# EAGLE design schematic_v2 (EAGLE 9.5.0)
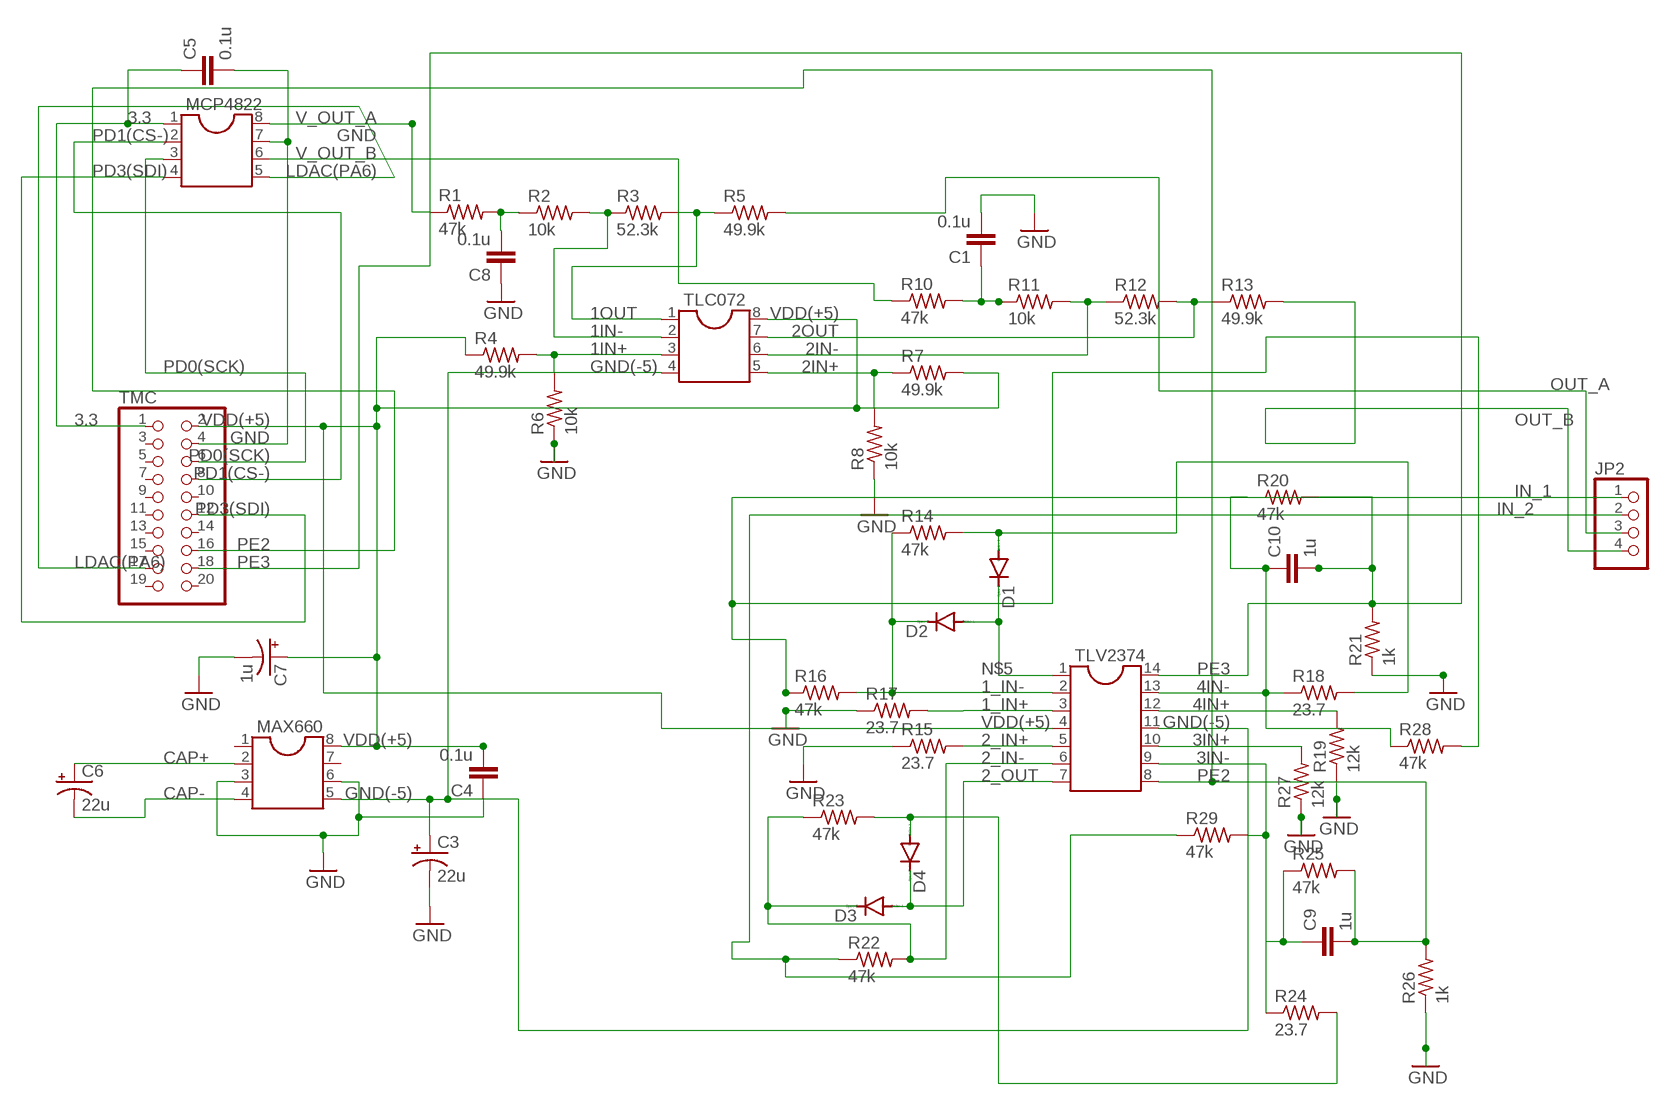
[diagram p0: schematic, sheet 1]

## Parts
C1  0.1u  C2.5/2  [C2.5-2]
C3  22u  CPOL-USE2.5-6  [E2,5-6]
C4  0.1u  C2.5/2  [C2.5-2]
C5  0.1u  C2.5/2  [C2.5-2]
C6  22u  CPOL-USE2.5-6  [E2,5-6]
C7  1u  CPOL-USE2.5-6  [E2,5-6]
C8  0.1u  C2.5/2  [C2.5-2]
C9  1u  C2.5/2  [C2.5-2]
C10  1u  C2.5/2  [C2.5-2]
D1  1N4148DO35-7  [DO35-7]
D2  1N4148DO35-7  [DO35-7]
D3  1N4148DO35-7  [DO35-7]
D4  1N4148DO35-7  [DO35-7]
JP2  PINHD-1X4  [1X04]
MAX660  DIL8  [DIL08]
MCP4822  DIL8  [DIL08]
R1  47k  R-US_0207/10  [0207/10]
R2  10k  R-US_0207/10  [0207/10]
R3  52.3k  R-US_0207/10  [0207/10]
R4  49.9k  R-US_0207/10  [0207/10]
R5  49.9k  R-US_0207/10  [0207/10]
R6  10k  R-US_0207/10  [0207/10]
R7  49.9k  R-US_0207/10  [0207/10]
R8  10k  R-US_0207/10  [0207/10]
R10  47k  R-US_0207/10  [0207/10]
R11  10k  R-US_0207/10  [0207/10]
R12  52.3k  R-US_0207/10  [0207/10]
R13  49.9k  R-US_0207/10  [0207/10]
R14  47k  R-US_0207/10  [0207/10]
R15  23.7  R-US_0207/10  [0207/10]
R16  47k  R-US_0207/10  [0207/10]
R17  23.7  R-US_0207/10  [0207/10]
R18  23.7  R-US_0207/10  [0207/10]
R19  12k  R-US_0207/10  [0207/10]
R20  47k  R-US_0207/10  [0207/10]
R21  1k  R-US_0207/10  [0207/10]
R22  47k  R-US_0207/10  [0207/10]
R23  47k  R-US_0207/10  [0207/10]
R24  23.7  R-US_0207/10  [0207/10]
R25  47k  R-US_0207/10  [0207/10]
R26  1k  R-US_0207/10  [0207/10]
R27  12k  R-US_0207/10  [0207/10]
R28  47k  R-US_0207/10  [0207/10]
R29  47k  R-US_0207/10  [0207/10]
TLC072  DIL8  [DIL08]
TLV2374  DIL14  [DIL14]
TMC  PINHD-2X10  [2X10]

## Nets
1_IN+: R17.2 TLV2374.3
1_IN-: D2.C R14.1 R16.2 TLV2374.2
1_OUT: D1.A R14.2 R18.2
1IN+: R4.2 R6.2 TLC072.3
1IN-: R2.2 R3.1 TLC072.2
1OUT: R3.2 R5.1 TLC072.1
2_IN+: R15.2 TLV2374.5
2_IN-: D3.C R22.2 R23.1 TLV2374.6
2_OUT: D3.A D4.C TLV2374.7
2IN+: R7.1 R8.2 TLC072.5
2IN-: R11.2 R12.1 TLC072.6
2OUT: R12.2 R13.1 TLC072.7
3.3: C5.1 MCP4822.1 TMC.1
3IN+: R27.2 TLV2374.10
3IN-: C9.1 R24.1 R25.1 R29.2 TLV2374.9
4IN+: R19.2 TLV2374.12
4IN-: C10.1 R18.1 R20.1 R28.1 TLV2374.13
CAP+: C6.+ MAX660.2
CAP-: C6.- MAX660.4
GND: C1.2 C3.- C4.1 C5.2 C7.- C8.1 MAX660.3 MAX660.6 MCP4822.7 R6.1 R8.1 R15.1 R17.1 R19.1 R21.1 R26.1 R27.1 TMC.4
GND(-5): C3.+ MAX660.5 TLC072.4 TLV2374.11
IN_1: JP2.1 R16.1 R28.2
IN_2: JP2.2 R22.1 R29.1
LDAC(PA6): MCP4822.5 TMC.17
N$1: R10.2 R11.1
N$2: C8.2 R1.2 R2.1
N$3: D4.A R23.2 R24.2
N$4: C1.1
N$5: D1.C D2.A TLV2374.1
OUT_A: JP2.3 R5.2
OUT_B: JP2.4 R13.2
PD0(SCK): MCP4822.3 TMC.6
PD1(CS-): MCP4822.2 TMC.8
PD3(SDI): MCP4822.4 TMC.12
PE2: C9.2 R25.2 R26.2 TLV2374.8 TMC.16
PE3: C10.2 R20.2 R21.2 TLV2374.14 TMC.18
V_OUT_A: MCP4822.8 R1.1
V_OUT_B: MCP4822.6 R10.1
VDD(+5): C4.2 C7.+ MAX660.8 R4.1 R7.2 TLC072.8 TLV2374.4 TMC.2
Unconnected: MAX660.1 MAX660.7 TMC.3 TMC.5 TMC.7 TMC.9 TMC.10 TMC.11 TMC.13 TMC.14 TMC.15 TMC.19 TMC.20

## Library data of the parts
C1 C4 C5 C8-C10 = capacitor-wima:C: CAPACITOR naming: grid - package width
C3 C6 C7 = adafruit:CPOL-US: POLARIZED CAPACITOR, American symbol
D1-D4 = diode:1N4148: DIODE high speed (Philips)
JP2 = pinhead:PINHD-1X4: PIN HEADER
MAX660 MCP4822 TLC072 = ic-package:DIL8: Dual In Line / Socket
R1-R8 R10-R29 = adafruit:R-US_: RESISTOR, American symbol
TLV2374 = ic-package:DIL14: Dual In Line / Socket
TMC = pinhead:PINHD-2X10: PIN HEADER

## Net classes
0 default: width 0.66 mm, drill 0.66 mm, clearance 0.66 mm

## Board
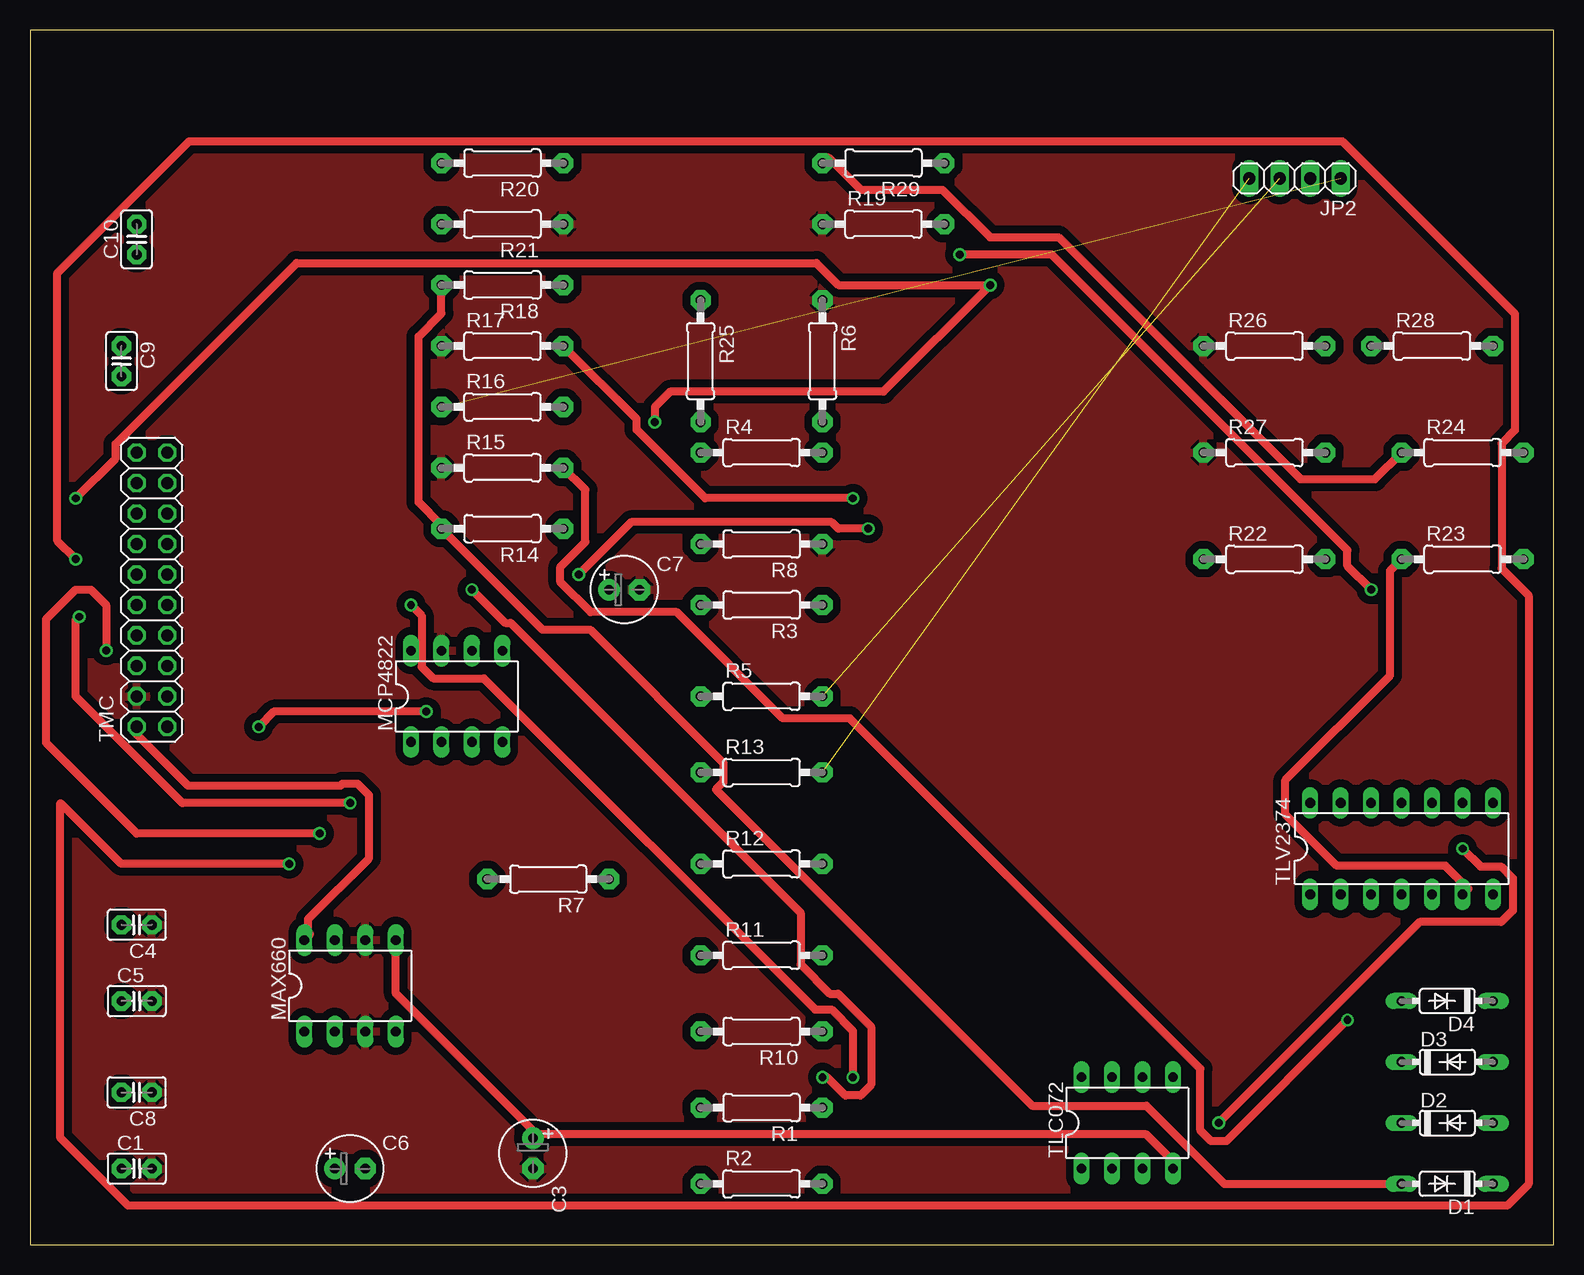
[diagram p1: board, top side]
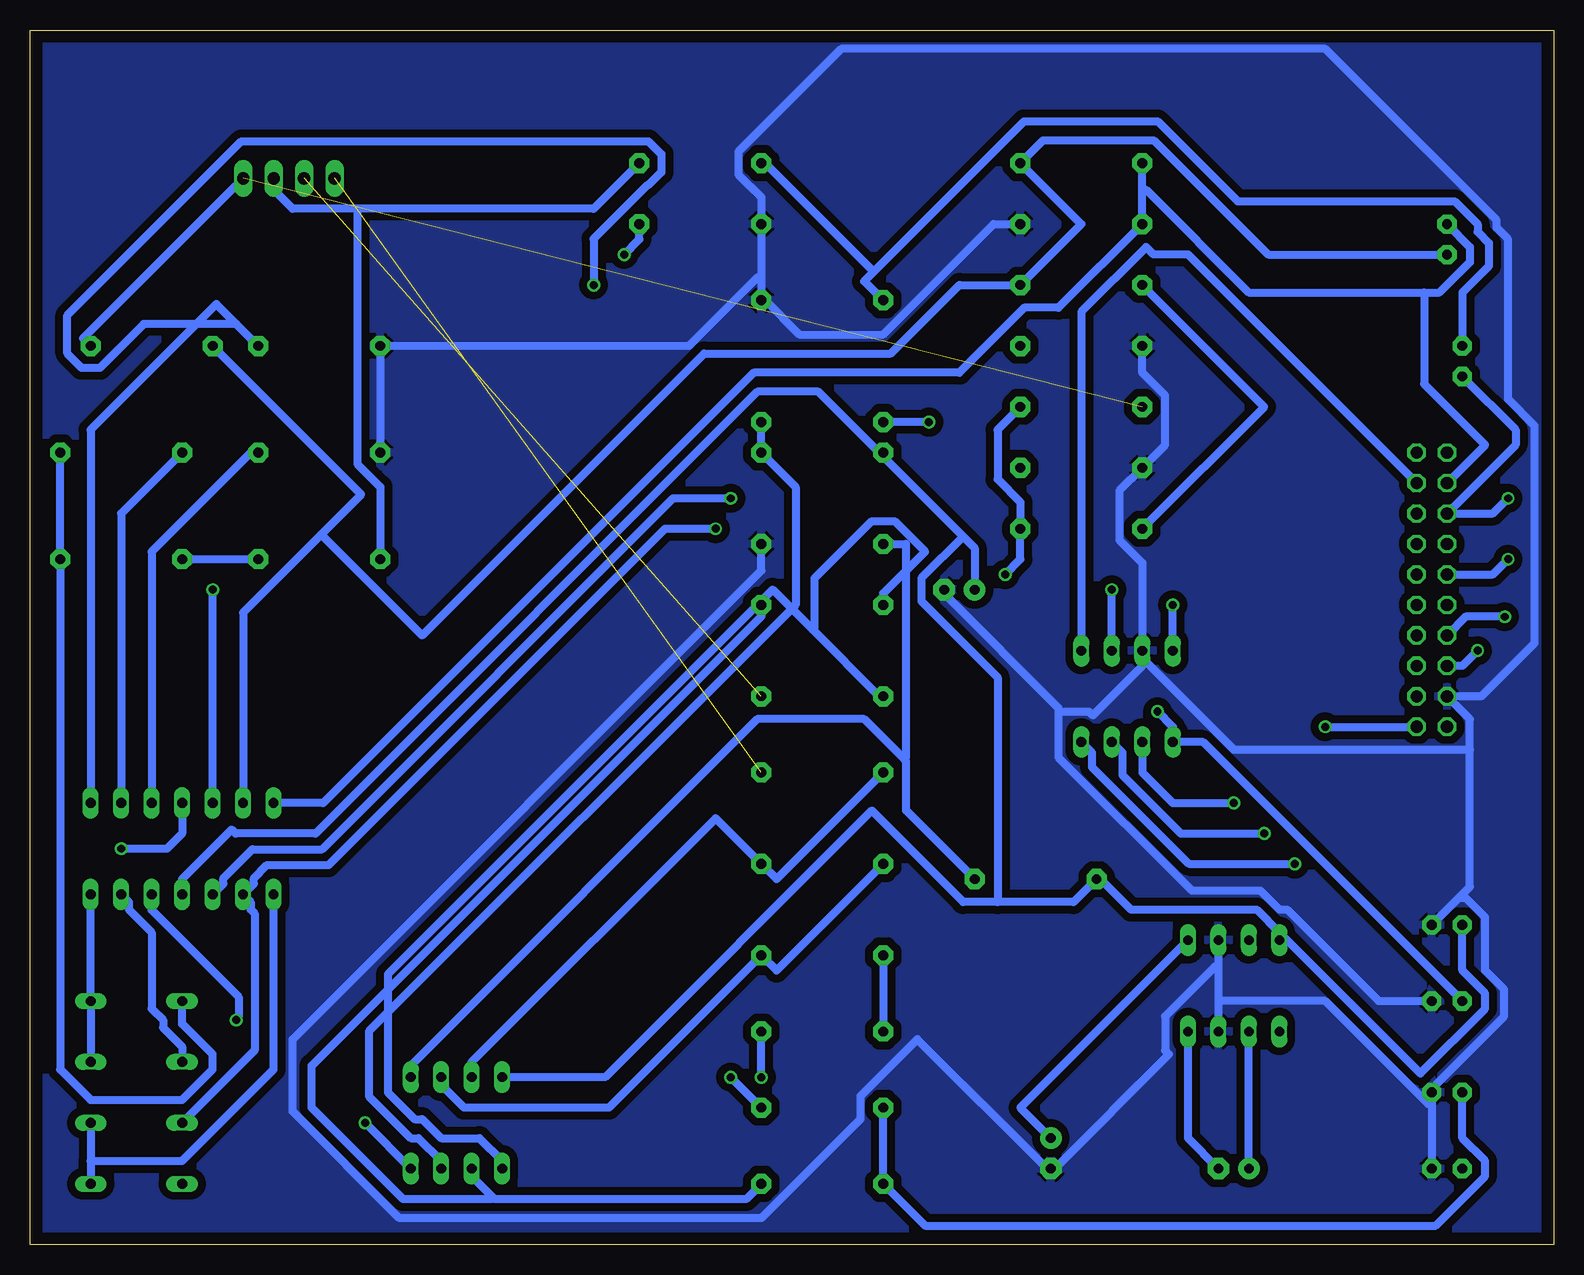
[diagram p2: board, bottom side, seen from below]

Size 126.98 x 101.27 mm. Coordinates in mm from the lower left corner, seen from the top.
Outline: 0,0 126.98,0 126.98,101.27 0,101.27 0,0
Copper layers (1*16): Top 0.035mm / dielectric 1.5mm / Bottom 0.035mm
Design rules "default": minimum track width 6mil, minimum drill 0.35mm, track to track 6mil, track to pad 6mil, pad to pad 6mil, via to via 6mil, smd to smd 6mil, copper to edge 40mil, drill to drill 6mil, minimum pad ring 10mil, minimum via ring 8mil, stop-mask expansion 4mil, vias tented up to drill 0mil, thermal gap 10mil

### Footprints (pad centres in the part's own frame; a part is rotated, then mirrored left to right if it is on the bottom)
C2.5-2 = drill 0.813 pad 1.6 octagon: 1 -1.27,0; 2 1.27,0
E2,5-6 = drill 0.813 pad 1.778: + -1.27,0 | drill 0.813 pad 1.778 octagon: - 1.27,0
DO35-7 = drill 0.813 long: A 3.81,0; C -3.81,0
1X04 = drill 1.016 long: 1 -3.81,0; 2 -1.27,0; 3 1.27,0; 4 3.81,0
DIL08 = drill 0.813 long: 1 -3.81,-3.81; 2 -1.27,-3.81; 3 1.27,-3.81; 4 3.81,-3.81; 5 3.81,3.81; 6 1.27,3.81; 7 -1.27,3.81; 8 -3.81,3.81
0207/10 = drill 0.813 pad 1.676 octagon: 1 -5.08,0; 2 5.08,0
DIL14 = drill 0.813 long: 1 -7.62,-3.81; 2 -5.08,-3.81; 3 -2.54,-3.81; 4 0,-3.81; 5 2.54,-3.81; 6 5.08,-3.81; 7 7.62,-3.81; 8 7.62,3.81; 9 5.08,3.81; 10 2.54,3.81; 11 0,3.81; 12 -2.54,3.81; 13 -5.08,3.81; 14 -7.62,3.81
2X10 = drill 1.016 octagon: 1 -11.43,-1.27; 2 -11.43,1.27; 3 -8.89,-1.27; 4 -8.89,1.27; 5 -6.35,-1.27; 6 -6.35,1.27; 7 -3.81,-1.27; 8 -3.81,1.27; 9 -1.27,-1.27; 10 -1.27,1.27; 11 1.27,-1.27; 12 1.27,1.27; 13 3.81,-1.27; 14 3.81,1.27; 15 6.35,-1.27; 16 6.35,1.27; 17 8.89,-1.27; 18 8.89,1.27; 19 11.43,-1.27; 20 11.43,1.27

### Placement (x,y rotation side)
C1  8.89,6.35 0 top
C3  41.91,7.62 270 top
C4  8.89,26.67 180 top
C5  8.89,20.32 0 top
C6  26.67,6.35 0 top
C7  49.53,54.61 0 top
C8  8.89,12.7 180 top
C9  7.62,73.66 270 top
C10  8.89,83.82 90 top
D1  118.11,5.08 180 top
D2  118.11,10.16 0 top
D3  118.11,15.24 0 top
D4  118.11,20.32 180 top
JP2  105.41,88.9 180 top
MAX660  26.67,21.59 0 top
MCP4822  35.56,45.72 0 top
R1  60.96,11.43 180 top
R2  60.96,5.08 0 top
R3  60.96,53.34 180 top
R4  60.96,66.04 0 top
R5  60.96,45.72 0 top
R6  66.04,73.66 270 top
R7  43.18,30.48 180 top
R8  60.96,58.42 180 top
R10  60.96,17.78 180 top
R11  60.96,24.13 0 top
R12  60.96,31.75 0 top
R13  60.96,39.37 0 top
R14  39.37,59.69 180 top
R15  39.37,64.77 0 top
R16  39.37,69.85 0 top
R17  39.37,74.93 0 top
R18  39.37,80.01 180 top
R19  71.12,85.09 0 top
R20  39.37,90.17 180 top
R21  39.37,85.09 180 top
R22  102.87,57.15 0 top
R23  119.38,57.15 0 top
R24  119.38,66.04 0 top
R25  55.88,73.66 270 top
R26  102.87,74.93 0 top
R27  102.87,66.04 0 top
R28  116.84,74.93 0 top
R29  71.12,90.17 180 top
TLC072  91.44,10.16 0 top
TLV2374  114.3,33.02 0 top
TMC  10.16,54.61 90 top

### Tracks (layer width: path | path; a pad name or v marks a point on that pad's centre or on a via)
1_IN+  (via drill 0.66)
  Top 0.66: R17.2 50.55,68.83 50.55,67.95 56.27,62.23 v68.58,62.23
  Bottom 0.66: TLV2374.3 110.87,30.1 110.87,30.55 108.46,32.97 102.64,32.97 73.38,62.23 v68.58,62.23
1_IN-  (via drill 0.66)
  Top 0.66: v69.85,59.69 67.36,59.69 66.8,60.25 50.09,60.25 v45.72,55.88
  Bottom 0.66: R16.2 46.35,67.94 46.35,63.82 44.45,61.91 R14.1 44.45,57.15 v45.72,55.88 | D2.C 108.27,16.19 108.27,27.62 108.58,27.94 108.58,28.57 TLV2374.2 108.33,30.1 108.33,30.55 107.24,31.65 102.09,31.65 74.05,59.69 v69.85,59.69
1_OUT
  Top 0.66: D1.A 99.54,5.08 93.03,11.59 83.5,11.59 57.15,37.94 57.78,38.58 57.78,40.16 46.67,51.28 42.7,51.28 R14.2 34.29,60.01 32.38,61.91 32.38,75.72 34.29,77.63 R18.2
  Bottom 0.66: R14.2 24.13,69.85 R18.2
1IN+
  Bottom 0.66: TLC072.3 92.71,6.99 94.61,8.89 95.25,8.89 98.74,12.38 98.74,17.78 63.18,53.34 63.18,63.18 R4.2 R6.2
1IN-
  Bottom 0.66: TLC072.2 90.17,5.71 88.42,3.97 | 88.42,3.97 88.27,3.81 67.31,3.81 R2.2 | R3.1 66.04,52.39 103.5,14.92 103.5,11.43 95.89,3.81 88.58,3.81 88.42,3.97
1OUT
  Bottom 0.66: TLC072.1 87.63,6.99 89.53,8.89 92.71,8.89 94.3,10.48 94.93,10.48 97.16,12.7 97.16,22.54 65.09,54.61 61.75,51.28 | 61.75,51.28 56.2,45.72 R5.1 | R3.2 55.88,54.29 52.39,57.78 54.93,60.33 56.83,60.33 61.59,55.56 61.59,51.44 61.75,51.28
2_IN+  (via drill 0.66)
  Top 0.66: R15.2 46.28,62.94 46.28,58.59 44.2,56.51 44.2,55.25 46.71,52.73 53.9,52.73 62.74,43.89 68.32,43.89 97.54,14.68 97.54,9.53 98.43,8.64 99.69,8.64 v109.79,18.74
  Bottom 0.66: TLV2374.5 116.84,27.9 109.59,20.65 109.59,18.94 v109.79,18.74
2_IN-
  Top 0.66: R23.1 113.35,56.2 113.35,47.47 104.62,38.73 104.62,35.88 108.9,31.59 117.95,31.59 119.86,29.69 TLV2374.6
  Bottom 0.66: D3.C 114.3,16.51 115.89,18.1 115.89,18.73 116.84,19.68 116.84,26.04 118.75,27.94 118.75,28.57 TLV2374.6 | R23.1 R22.2
2_OUT
  Bottom 0.66: D3.A D4.C TLV2374.7
2IN+
  Bottom 0.66: TLC072.5 95.25,14.92 66.36,43.81 57.47,43.81 54.13,40.48 | 54.13,40.48 53.98,40.32 53.98,36.2 R7.1 | R8.2 53.98,58.42 53.98,40.64 54.13,40.48
2IN-
  Bottom 0.66: TLC072.6 92.71,13.34 90.81,11.43 78.74,11.43 R11.2 64.77,22.86 R12.1
2OUT
  Bottom 0.66: TLC072.7 90.17,15.24 69.85,35.56 R12.2 64.77,30.48 R13.1
3.3  (via drill 0.66)
  Top 0.66: v33.02,44.45 20.32,44.45 v19.05,43.18
  Bottom 0.66: C5.1 29.21,41.91 MCP4822.1 31.75,43.18 v33.02,44.45 | v19.05,43.18 TMC.1
3IN+
  Bottom 0.66: TLV2374.10 116.84,57.78 108.27,66.36 R27.2
3IN-
  Top 0.66: R24.1 112.08,63.82 105.89,63.82 85.72,83.98 80.01,83.98 76.04,87.95 69.22,87.95 66.52,90.65 R29.2
  Bottom 0.66: TLV2374.9 119.38,60.96 R24.1 | C9.1 7.62,79.38 5.4,81.6 5.4,83.5 6.35,84.45 6.35,85.09 8.26,87 26.35,87 33.02,93.66 44.13,93.66 56.67,81.12 | 56.67,81.12 57.47,80.33 R25.1 | R29.2 65.72,90.17 56.67,81.12
4IN+  (via drill 0.66)
  Top 0.66: v111.76,54.61 109.78,56.59 109.78,57.91 85.14,82.55 v77.47,82.55
  Bottom 0.66: TLV2374.12 v111.76,54.61 | v77.47,82.55 76.2,83.82 R19.2
4IN-
  Bottom 0.66: C10.1 23.81,82.55 33.34,92.08 42.55,92.08 R20.1 39.37,85.09 R18.1 49.53,80.01 55.24,74.3 70.8,74.3 94.3,50.8 102.71,59.21 | TLV2374.13 109.22,52.7 102.71,59.21 | 102.71,59.21 99.38,62.55 R28.1
CAP+
  Bottom 0.66: C6.+ MAX660.2
CAP-
  Bottom 0.66: MAX660.4 30.48,8.89 C6.-
GND
  Bottom 0.66: R8.1 66.04,56.2 105.09,17.14 105.09,11.11 96.2,2.22 66.04,2.22 57.78,10.48 57.78,12.38 53.02,17.14 42.23,6.35 C3.- 41.59,6.35 32.07,15.88 32.38,16.19 32.38,19.05 28.26,23.18 27.94,23.18 | R27.1 R26.1 72.07,74.93 66.36,80.64 66.04,80.64 | 66.04,80.64 R19.1 66.04,87.31 67.94,89.22 67.94,91.12 59.37,99.69 19.05,99.69 4.76,85.41 4.76,84.77 3.81,83.82 3.81,70.48 1.59,68.26 1.59,50.16 6.03,45.72 TMC.4 6.99,43.81 6.99,41.27 | 66.04,80.64 R6.1 65.72,78.74 62.87,75.88 55.88,75.88 46.67,85.09 R21.1 | 6.99,41.27 6.99,29.84 7.78,29.05 | C4.1 7.78,29.05 | MAX660.6 27.94,23.18 | 27.94,23.18 27.94,20.32 | 27.94,20.32 MAX660.3 | 10.16,11.75 C8.1 10.16,13.02 4.13,19.05 4.13,21.27 5.71,22.86 5.71,27.3 7.3,28.89 7.62,28.89 7.78,29.05 | 10.16,11.75 C1.2 | 27.94,20.32 19.05,20.32 10.48,11.75 10.16,11.75 | MCP4822.7 34.29,56.83 36.2,58.74 36.2,62.87 R15.1 32.38,66.67 32.38,70.8 34.29,72.71 R17.1 | C5.2 14.61,20.32 22.23,27.94 22.86,27.94 24.45,29.53 30.16,29.53 41.27,40.64 41.27,44.45 | 41.27,44.45 41.27,44.77 50.8,54.29 C7.- | MCP4822.7 34.29,48.26 38.42,44.13 38.73,44.45 41.27,44.45 | 6.99,41.27 26.67,41.27 34.29,48.9 MCP4822.7
  pour Bottom: -5.08,104.14 -5.08,-2.54 0,-7.62 128.27,-7.62 133.35,-2.54 133.35,102.87 130.81,105.41 -3.81,105.41
  pour Top: -7.62,106.68 -7.62,-5.08 -1.27,-11.43 129.54,-11.43 137.16,-3.81 137.16,105.41 133.35,109.22 -3.81,109.22
GND(-5)  (via drill 0.66)
  Top 0.66: v99.06,10.16 115.8,26.9 122.6,26.9 123.57,27.87 123.57,30.55 122.6,31.52 120.88,31.52 v119.38,33.02 | MAX660.5 30.48,20.95 42.23,9.21 C3.+ 42.55,9.21 93.03,9.21 95.57,6.67 TLC072.4
  Bottom 0.66: MAX660.5 44.45,11.43 C3.+ | TLV2374.11 114.3,34.29 115.57,33.02 v119.38,33.02 | v99.06,10.16 TLC072.4
IN_1  (1 unrouted)
  Bottom 0.66: JP2.1 122.56,75.56 R28.2
IN_2
  Bottom 0.66: JP2.2 106.68,87.95 105.09,86.36 99.69,86.36 | 99.69,86.36 80.01,86.36 R29.1 | R22.1 97.79,63.18 99.69,65.09 99.69,86.36
LDAC(PA6)
  Bottom 0.66: MCP4822.5 39.37,77.79 33.97,83.19 33.34,82.55 30.48,82.55 TMC.17
N$1
  Bottom 0.66: R11.1 R10.2
N$2
  Bottom 0.66: C8.2 7.62,8.89 5.71,6.99 5.71,5.71 9.84,1.59 52.39,1.59 R2.1 R1.2
N$3
  Bottom 0.66: D4.A 114.3,18.41 111.76,15.88 111.76,14.61 114.3,12.06 121.92,12.06 124.46,14.61 R23.2 R24.2
N$5
  Bottom 0.66: D2.A 121.92,6.99 | 121.92,6.99 D1.C | TLV2374.1 106.68,14.61 114.3,6.99 121.92,6.99
OUT_A  (1 unrouted)
OUT_B  (1 unrouted)
PD0(SCK)  (via drill 0.66)
  Top 0.66: v24.13,34.29 8.89,34.29 1.35,41.83 1.35,52.15 3.81,54.61 5.08,54.61 6.35,53.34 v6.35,49.53
  Bottom 0.66: MCP4822.3 35.94,41.02 35.94,39.15 31.08,34.29 v24.13,34.29 | v6.35,49.53 7.62,48.26 TMC.6
PD1(CS-)  (via drill 0.66)
  Top 0.66: v26.67,36.83 12.7,36.83 3.81,45.72 3.81,52.07 v4.09,52.35
  Bottom 0.66: MCP4822.2 34.29,39.37 31.75,36.83 v26.67,36.83 | v4.09,52.35 7.34,52.35 TMC.8
PD3(SDI)  (via drill 0.66)
  Top 0.66: v21.59,31.75 7.62,31.75 2.54,36.83 2.54,8.9 8.19,3.25 123.09,3.25 124.89,5.06 124.89,54.13 122.63,56.39 122.63,66.8 123.75,67.92 123.75,77.61 109.36,92 13.27,92 2.29,81.02 2.29,58.67 v3.81,57.15
  Bottom 0.66: MCP4822.4 38.48,41.02 38.48,39.83 30.41,31.75 v21.59,31.75 | TMC.12 5.08,55.88 v3.81,57.15
PE2  (via drill 0.66)
  Top 0.66: v52.07,68.58 52.07,69.85 53.34,71.12 71.12,71.12 v80.01,80.01 67.36,80.01 65.53,81.84 22.21,81.84 7.14,66.77 7.14,65.56 v3.81,62.23
  Bottom 0.66: C9.2 3.17,67.94 3.17,66.67 TMC.16 5.08,60.96 v3.81,62.23 | TLV2374.8 121.92,67.94 111.44,78.42 R26.2 109.78,76.76 117.5,76.76 121.16,73.1 122.68,73.1 123.88,74.3 123.88,77.48 109.36,92 75.44,92 74.37,90.93 74.37,89.41 75.44,88.34 75.53,88.34 80.01,83.87 v80.01,80.01 | v52.07,68.58 R25.2
PE3
  Bottom 0.66: TMC.18 5.71,66.67 10.79,71.75 10.79,79.38 | C10.2 6.99,83.19 6.99,81.92 9.53,79.38 10.79,79.38 | TLV2374.14 102.55,36.83 66.67,72.71 49.53,72.71 44.13,78.11 41.27,78.11 R21.2 34.29,87.95 | 34.29,87.95 R20.2 | 10.79,79.38 25.4,79.38 33.97,87.95 34.29,87.95
V_OUT_A  (via drill 0.66)
  Top 0.66: v31.75,53.34 32.64,52.45 32.64,48.19 33.61,47.22 37.83,47.22 65.44,19.61 66.8,19.61 68.58,17.83 v68.58,13.97
  Bottom 0.66: MCP4822.8 v31.75,53.34 | v68.58,13.97 R1.1
V_OUT_B  (via drill 0.66)
  Top 0.66: v36.83,54.61 39.6,51.84 40.05,51.84 64.21,27.68 64.21,23.37 66.65,20.93 67.34,20.93 70.1,18.17 70.1,13.34 69.21,12.45 67.95,12.45 66.42,13.97 v66.04,13.97
  Bottom 0.66: MCP4822.6 v36.83,54.61 | v66.04,13.97 R10.1
VDD(+5)
  Top 0.66: TMC.2 8.57,42.86 13.18,38.26 25.88,38.26 26.04,38.42 27.3,38.42 28.26,37.47 28.26,32.23 23.18,27.15 23.18,26.04 23.34,25.88 MAX660.8
  Bottom 0.66: TLC072.8 79.06,13.97 56.83,36.2 49.21,28.57 46.35,28.57 | 46.35,28.57 40.01,28.57 R7.2 37.78,30.48 35.24,27.94 24.77,27.94 22.86,26.04 MAX660.8 22.54,25.72 11.11,14.29 5.71,19.68 5.71,20.95 7.62,22.86 C4.2 | TLV2374.4 114.3,30.48 110.17,34.61 109.86,34.29 103.19,34.29 66.36,71.12 61.28,71.12 56.2,66.04 R4.1 55.88,65.72 49.21,59.05 | C7.+ 48.26,58.1 49.21,59.05 | 46.35,28.57 46.35,47.31 52.7,53.66 52.7,55.56 49.21,59.05